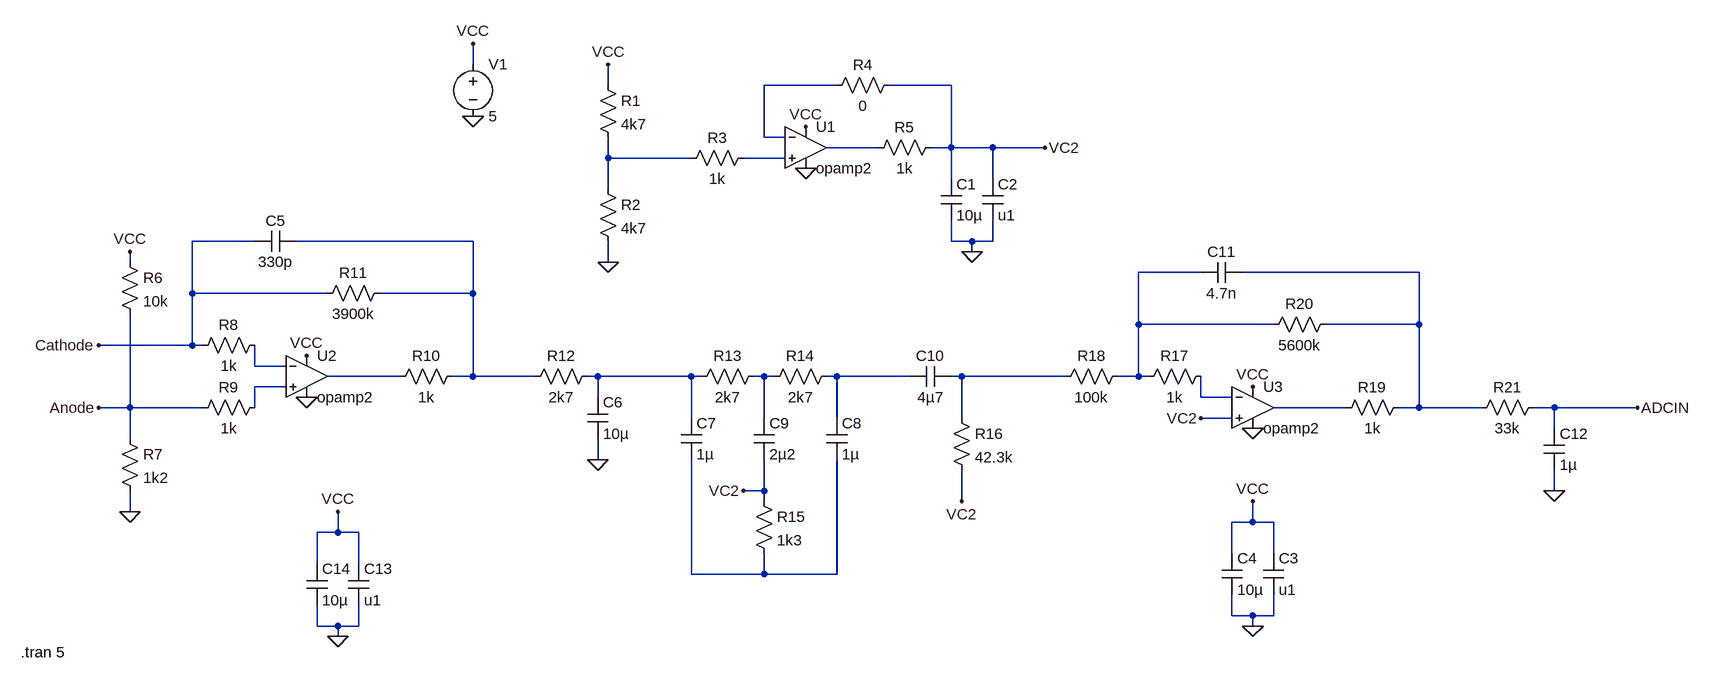
[diagram p0: schematic Receiver.asc]
Receiver.asc, the LTspice schematic file:
Version 4
SHEET 1 3396 868
WIRE 1504 -256 1504 -288
WIRE 1712 -224 1712 -256
WIRE 2064 -224 1952 -224
WIRE 2240 -224 2144 -224
WIRE 1952 -144 1952 -224
WIRE 1984 -144 1952 -144
WIRE 2128 -128 2048 -128
WIRE 2240 -128 2240 -224
WIRE 2240 -128 2208 -128
WIRE 2304 -128 2240 -128
WIRE 2384 -128 2304 -128
WIRE 1712 -112 1712 -144
WIRE 1840 -112 1712 -112
WIRE 1984 -112 1920 -112
WIRE 2240 -80 2240 -128
WIRE 2304 -80 2304 -128
WIRE 1712 -64 1712 -112
WIRE 1168 16 1072 16
WIRE 1504 16 1232 16
WIRE 2240 16 2240 -16
WIRE 2272 16 2240 16
WIRE 2304 16 2304 -16
WIRE 2304 16 2272 16
WIRE 2272 32 2272 16
WIRE 976 48 976 32
WIRE 1712 48 1712 16
WIRE 2624 64 2528 64
WIRE 2960 64 2688 64
WIRE 1072 96 1072 16
WIRE 1280 96 1072 96
WIRE 1504 96 1504 16
WIRE 1504 96 1360 96
WIRE 2528 144 2528 64
WIRE 2736 144 2528 144
WIRE 2960 144 2960 64
WIRE 2960 144 2816 144
WIRE 1072 176 1072 96
WIRE 1072 176 928 176
WIRE 1088 176 1072 176
WIRE 1168 208 1168 176
WIRE 1216 208 1168 208
WIRE 1392 224 1280 224
WIRE 1504 224 1504 96
WIRE 1504 224 1472 224
WIRE 1600 224 1504 224
WIRE 1696 224 1680 224
WIRE 1840 224 1696 224
WIRE 1856 224 1840 224
WIRE 1952 224 1936 224
WIRE 1968 224 1952 224
WIRE 2064 224 2048 224
WIRE 2176 224 2064 224
WIRE 2256 224 2240 224
WIRE 2416 224 2256 224
WIRE 2528 224 2528 144
WIRE 2528 224 2496 224
WIRE 2544 224 2528 224
WIRE 1216 240 1168 240
WIRE 1696 256 1696 224
WIRE 2624 256 2624 224
WIRE 2672 256 2624 256
WIRE 976 272 976 128
WIRE 976 272 928 272
WIRE 1088 272 976 272
WIRE 1168 272 1168 240
WIRE 2848 272 2736 272
WIRE 2960 272 2960 144
WIRE 2960 272 2928 272
WIRE 3056 272 2960 272
WIRE 3168 272 3136 272
WIRE 3296 272 3168 272
WIRE 1840 288 1840 224
WIRE 1952 288 1952 224
WIRE 2064 288 2064 224
WIRE 2256 288 2256 224
WIRE 2672 288 2624 288
WIRE 3168 304 3168 272
WIRE 976 320 976 272
WIRE 1696 352 1696 320
WIRE 1952 400 1952 352
WIRE 1952 400 1920 400
WIRE 3168 400 3168 368
WIRE 1952 416 1952 400
WIRE 2256 416 2256 368
WIRE 976 432 976 400
WIRE 2704 448 2704 416
WIRE 2704 448 2672 448
WIRE 2736 448 2704 448
WIRE 1296 464 1296 432
WIRE 1296 464 1264 464
WIRE 1328 464 1296 464
WIRE 2672 496 2672 448
WIRE 2736 496 2736 448
WIRE 1264 512 1264 464
WIRE 1328 512 1328 464
WIRE 1840 528 1840 352
WIRE 1952 528 1952 496
WIRE 1952 528 1840 528
WIRE 2064 528 2064 352
WIRE 2064 528 1952 528
WIRE 2672 592 2672 560
WIRE 2704 592 2672 592
WIRE 2736 592 2736 560
WIRE 2736 592 2704 592
WIRE 1264 608 1264 576
WIRE 1296 608 1264 608
WIRE 1328 608 1328 576
WIRE 1328 608 1296 608
WIRE 2704 608 2704 592
WIRE 1296 624 1296 608
FLAG 1712 48 0
FLAG 1712 -256 VCC
FLAG 2272 32 0
FLAG 2016 -96 0
FLAG 2016 -160 VCC
FLAG 2384 -128 VC2
FLAG 1504 -176 0
FLAG 1504 -288 VCC
FLAG 2704 608 0
FLAG 2704 416 VCC
FLAG 976 32 VCC
FLAG 976 432 0
FLAG 928 272 Anode
FLAG 928 176 Cathode
FLAG 1248 256 0
FLAG 1248 192 VCC
FLAG 1696 352 0
FLAG 1920 400 VC2
FLAG 2256 416 VC2
FLAG 2704 304 0
FLAG 2704 240 VCC
FLAG 2624 288 VC2
FLAG 3168 400 0
FLAG 3296 272 ADCIN
FLAG 1296 624 0
FLAG 1296 432 VCC
SYMBOL res 1696 -240 R0
SYMATTR InstName R1
SYMATTR Value 4k7
SYMBOL res 1696 -80 R0
SYMATTR InstName R2
SYMATTR Value 4k7
SYMBOL res 1936 -128 R90
WINDOW 0 0 56 VBottom 2
WINDOW 3 32 56 VTop 2
SYMATTR InstName R3
SYMATTR Value 1k
SYMBOL Opamps\\opamp2 2016 -192 R0
SYMATTR InstName U1
SYMBOL res 2224 -144 R90
WINDOW 0 0 56 VBottom 2
WINDOW 3 32 56 VTop 2
SYMATTR InstName R5
SYMATTR Value 1k
SYMBOL res 2160 -240 R90
WINDOW 0 0 56 VBottom 2
WINDOW 3 32 56 VTop 2
SYMATTR InstName R4
SYMATTR Value 0
SYMBOL cap 2224 -80 R0
SYMATTR InstName C1
SYMATTR Value 10µ
SYMBOL cap 2288 -80 R0
SYMATTR InstName C2
SYMATTR Value u1
SYMBOL voltage 1504 -272 R0
WINDOW 123 0 0 Left 2
WINDOW 39 0 0 Left 2
SYMATTR InstName V1
SYMATTR Value 5
SYMBOL cap 2720 496 R0
SYMATTR InstName C3
SYMATTR Value u1
SYMBOL cap 2656 496 R0
SYMATTR InstName C4
SYMATTR Value 10µ
SYMBOL Opamps\\opamp2 1248 160 R0
SYMATTR InstName U2
SYMBOL res 960 32 R0
SYMATTR InstName R6
SYMATTR Value 10k
SYMBOL res 960 304 R0
SYMATTR InstName R7
SYMATTR Value 1k2
SYMBOL res 1184 160 R90
WINDOW 0 0 56 VBottom 2
WINDOW 3 32 56 VTop 2
SYMATTR InstName R8
SYMATTR Value 1k
SYMBOL res 1184 256 R90
WINDOW 0 0 56 VBottom 2
WINDOW 3 32 56 VTop 2
SYMATTR InstName R9
SYMATTR Value 1k
SYMBOL res 1488 208 R90
WINDOW 0 0 56 VBottom 2
WINDOW 3 32 56 VTop 2
SYMATTR InstName R10
SYMATTR Value 1k
SYMBOL res 1376 80 R90
WINDOW 0 0 56 VBottom 2
WINDOW 3 32 56 VTop 2
SYMATTR InstName R11
SYMATTR Value 3900k
SYMBOL cap 1232 0 R90
WINDOW 0 0 32 VBottom 2
WINDOW 3 32 32 VTop 2
SYMATTR InstName C5
SYMATTR Value 330p
SYMBOL res 1696 208 R90
WINDOW 0 0 56 VBottom 2
WINDOW 3 32 56 VTop 2
SYMATTR InstName R12
SYMATTR Value 2k7
SYMBOL cap 1680 256 R0
SYMATTR InstName C6
SYMATTR Value 10µ
SYMBOL res 1952 208 R90
WINDOW 0 0 56 VBottom 2
WINDOW 3 32 56 VTop 2
SYMATTR InstName R13
SYMATTR Value 2k7
SYMBOL res 2064 208 R90
WINDOW 0 0 56 VBottom 2
WINDOW 3 32 56 VTop 2
SYMATTR InstName R14
SYMATTR Value 2k7
SYMBOL cap 1824 288 R0
SYMATTR InstName C7
SYMATTR Value 1µ
SYMBOL cap 2048 288 R0
SYMATTR InstName C8
SYMATTR Value 1µ
SYMBOL cap 1936 288 R0
SYMATTR InstName C9
SYMATTR Value 2µ2
SYMBOL res 1936 400 R0
SYMATTR InstName R15
SYMATTR Value 1k3
SYMBOL cap 2240 208 R90
WINDOW 0 0 32 VBottom 2
WINDOW 3 32 32 VTop 2
SYMATTR InstName C10
SYMATTR Value 4µ7
SYMBOL res 2240 272 R0
SYMATTR InstName R16
SYMATTR Value 42.3k
SYMBOL Opamps\\opamp2 2704 208 R0
SYMATTR InstName U3
SYMBOL res 2640 208 R90
WINDOW 0 0 56 VBottom 2
WINDOW 3 32 56 VTop 2
SYMATTR InstName R17
SYMATTR Value 1k
SYMBOL res 2944 256 R90
WINDOW 0 0 56 VBottom 2
WINDOW 3 32 56 VTop 2
SYMATTR InstName R19
SYMATTR Value 1k
SYMBOL res 2832 128 R90
WINDOW 0 0 56 VBottom 2
WINDOW 3 32 56 VTop 2
SYMATTR InstName R20
SYMATTR Value 5600k
SYMBOL cap 2688 48 R90
WINDOW 0 0 32 VBottom 2
WINDOW 3 32 32 VTop 2
SYMATTR InstName C11
SYMATTR Value 4.7n
SYMBOL res 2512 208 R90
WINDOW 0 0 56 VBottom 2
WINDOW 3 32 56 VTop 2
SYMATTR InstName R18
SYMATTR Value 100k
SYMBOL res 3152 256 R90
WINDOW 0 0 56 VBottom 2
WINDOW 3 32 56 VTop 2
SYMATTR InstName R21
SYMATTR Value 33k
SYMBOL cap 3152 304 R0
SYMATTR InstName C12
SYMATTR Value 1µ
SYMBOL cap 1312 512 R0
SYMATTR InstName C13
SYMATTR Value u1
SYMBOL cap 1248 512 R0
SYMATTR InstName C14
SYMATTR Value 10µ
TEXT 808 648 Left 2 !.tran 5

The netlist it stands for:
* Receiver.asc
R1 VCC N003 4k7
R2 N003 0 4k7
R3 N004 N003 1k
XU1 N004 N001 VCC 0 N002 opamp2  ; pins In+ In- V+ V- OUT
R5 VC2 N002 1k
R4 VC2 N001 0
C1 VC2 0 10µ
C2 VC2 0 u1
V1 VCC 0 5
C3 VCC 0 u1
C4 VCC 0 10µ
XU2 N014 N008 VCC 0 N009 opamp2  ; pins In+ In- V+ V- OUT
R6 VCC Anode 10k
R7 Anode 0 1k2
R8 N008 Cathode 1k
R9 N014 Anode 1k
R10 N005 N009 1k
R11 N005 Cathode 3900k
C5 N005 Cathode 330p
R12 N010 N005 2k7
C6 N010 0 10µ
R13 N011 N010 2k7
R14 N012 N011 2k7
C7 N010 N017 1µ
C8 N012 N017 1µ
C9 N011 VC2 2µ2
R15 VC2 N017 1k3
C10 N013 N012 4µ7
R16 N013 VC2 42.3k
XU3 VC2 N015 VCC 0 N016 opamp2  ; pins In+ In- V+ V- OUT
R17 N015 N006 1k
R19 N007 N016 1k
R20 N007 N006 5600k
C11 N007 N006 4.7n
R18 N006 N013 100k
R21 ADCIN N007 33k
C12 ADCIN 0 1µ
C13 VCC 0 u1
C14 VCC 0 10µ
.tran 5
.backanno
.end